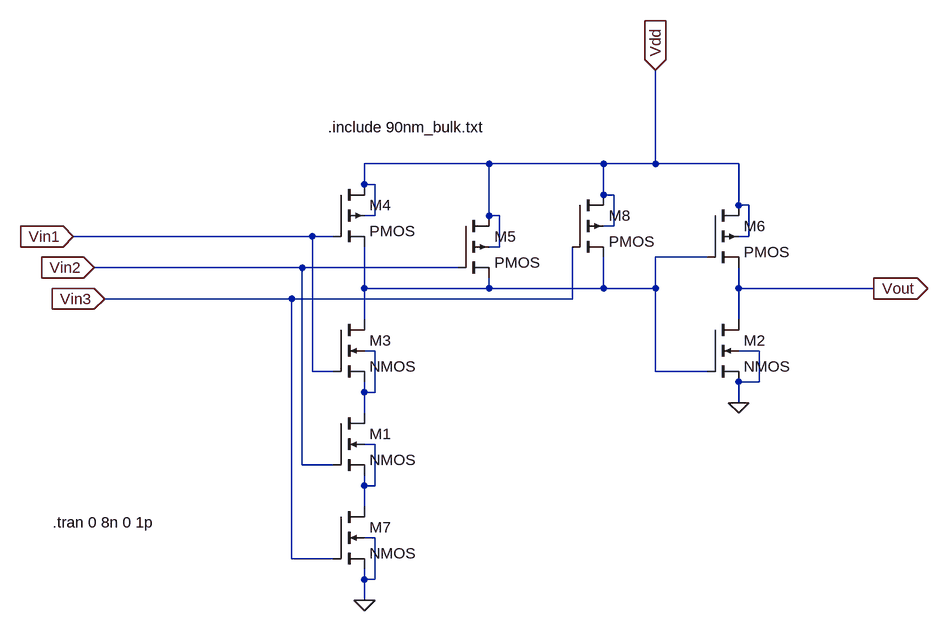
[diagram p0: schematic and3.asc]
and3.asc, the LTspice schematic file:
Version 4
SHEET 1 1064 756
WIRE 352 64 160 64
WIRE 528 64 352 64
WIRE 608 64 608 -80
WIRE 608 64 528 64
WIRE 736 64 608 64
WIRE 160 96 160 64
WIRE 176 96 160 96
WIRE 528 112 528 64
WIRE 544 112 528 112
WIRE 736 128 736 64
WIRE 752 128 736 128
WIRE 176 144 176 96
WIRE 176 144 160 144
WIRE 352 144 352 64
WIRE 368 144 352 144
WIRE 544 160 544 112
WIRE 544 160 528 160
WIRE 80 176 -288 176
WIRE 112 176 80 176
WIRE 752 176 752 128
WIRE 752 176 736 176
WIRE 368 192 368 144
WIRE 368 192 352 192
WIRE 688 208 608 208
WIRE 64 224 -256 224
WIRE 304 224 64 224
WIRE 160 256 160 192
WIRE 352 256 352 240
WIRE 352 256 160 256
WIRE 528 256 528 208
WIRE 528 256 352 256
WIRE 608 256 608 208
WIRE 608 256 528 256
WIRE 736 256 736 224
WIRE 944 256 736 256
WIRE 48 272 -240 272
WIRE 480 272 480 192
WIRE 480 272 48 272
WIRE 160 304 160 256
WIRE 736 304 736 256
WIRE 176 352 160 352
WIRE 768 352 736 352
WIRE 80 384 80 176
WIRE 112 384 80 384
WIRE 608 384 608 256
WIRE 688 384 608 384
WIRE 768 400 768 352
WIRE 768 400 736 400
WIRE 160 416 160 400
WIRE 176 416 176 352
WIRE 176 416 160 416
WIRE 736 432 736 400
WIRE 160 448 160 416
WIRE 176 496 160 496
WIRE 64 528 64 224
WIRE 112 528 64 528
WIRE 160 560 160 544
WIRE 176 560 176 496
WIRE 176 560 160 560
WIRE 160 592 160 560
WIRE 176 640 160 640
WIRE 48 672 48 272
WIRE 112 672 48 672
WIRE 160 704 160 688
WIRE 176 704 176 640
WIRE 176 704 160 704
WIRE 160 736 160 704
FLAG -288 176 Vin1
IOPIN -288 176 In
FLAG -256 224 Vin2
IOPIN -256 224 In
FLAG 944 256 Vout
IOPIN 944 256 Out
FLAG 608 -80 Vdd
IOPIN 608 -80 In
FLAG 736 432 0
FLAG -240 272 Vin3
IOPIN -240 272 In
FLAG 160 736 0
SYMBOL nmos4 112 448 R0
SYMATTR InstName M1
SYMATTR Value2 l=90n w=200n
SYMBOL nmos4 688 304 R0
SYMATTR InstName M2
SYMATTR Value2 l=90n w=200n
SYMBOL nmos4 112 304 R0
SYMATTR InstName M3
SYMATTR Value2 l=90n w=200n
SYMBOL pmos4 112 96 R0
SYMATTR InstName M4
SYMATTR Value2 l=90n w=400n
SYMBOL pmos4 304 144 R0
SYMATTR InstName M5
SYMATTR Value2 l=90n w=400n
SYMBOL pmos4 688 128 R0
SYMATTR InstName M6
SYMATTR Value2 l=90n w=400n
SYMBOL nmos4 112 592 R0
SYMATTR InstName M7
SYMATTR Value2 l=90n w=200n
SYMBOL pmos4 480 112 R0
SYMATTR InstName M8
SYMATTR Value2 l=90n w=400n
TEXT 104 8 Left 2 !.include 90nm_bulk.txt
TEXT -320 616 Left 2 !.tran 0 8n 0 1p

The netlist it stands for:
* and3.asc
M1 N002 Vin2 N003 N003 NMOS l=90n w=200n
M2 Vout N001 0 0 NMOS l=90n w=200n
M3 N001 Vin1 N002 N002 NMOS l=90n w=200n
M4 Vdd Vin1 N001 Vdd PMOS l=90n w=400n
M5 Vdd Vin2 N001 Vdd PMOS l=90n w=400n
M6 Vdd N001 Vout Vdd PMOS l=90n w=400n
M7 N003 Vin3 0 0 NMOS l=90n w=200n
M8 Vdd Vin3 N001 Vdd PMOS l=90n w=400n
.model NMOS NMOS
.model PMOS PMOS
.lib standard.mos
.include 90nm_bulk.txt
.tran 0 8n 0 1p
.backanno
.end